# EAGLE schematic ADS126x_hookup (EAGLE 9.6.2)
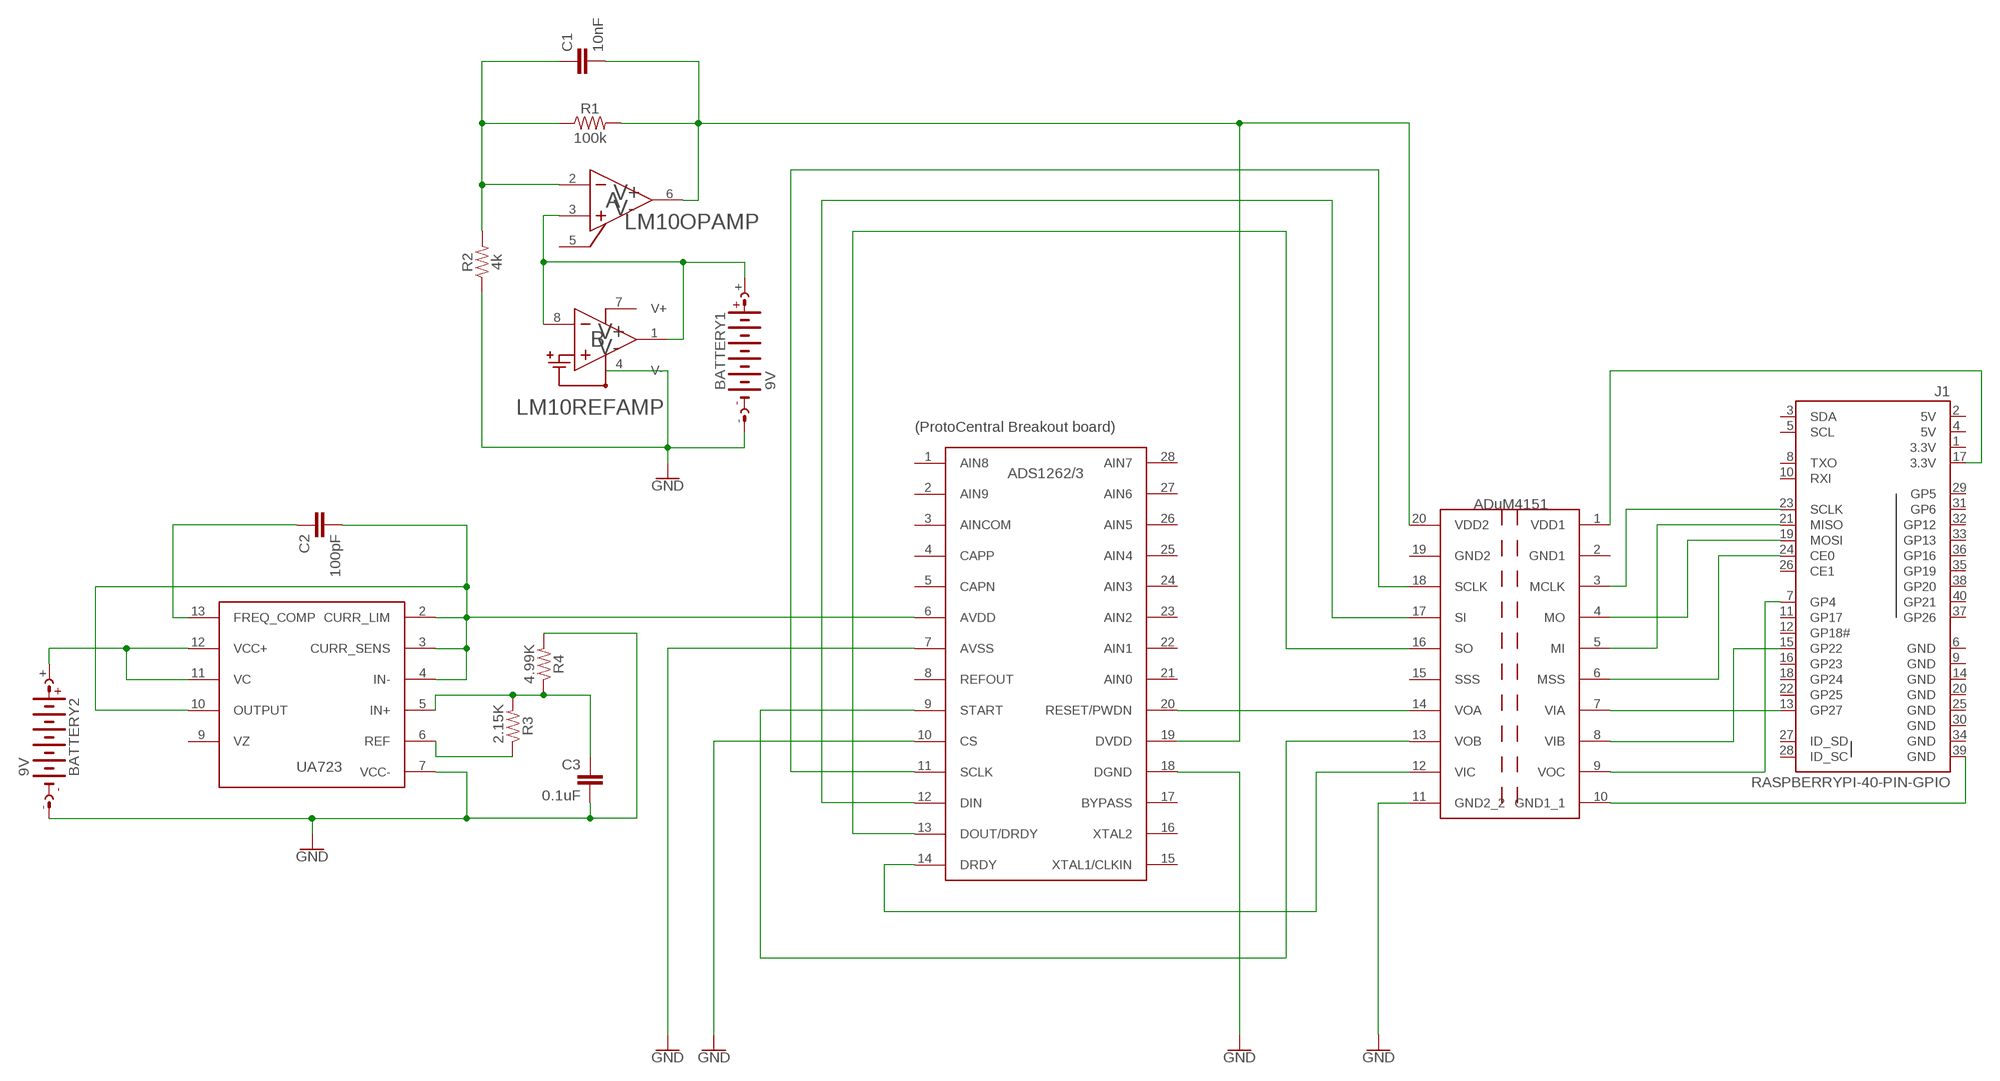
[diagram p0: schematic, sheet 1]

## Parts
BATTERY1  9V  AB9V  [AB9V]
BATTERY2  9V  AB9V  [AB9V]
C1  10nF  10NF-PTH-10MM-10000V-1-%  [CAP-PTH-10MM]
C2  100pF  100PF-0603-50V-5%  [0603]
C3  0.1uF  0.1UF-0603-25V-5%  [0603]
J1  RASPBERRYPI-40-PIN-GPIO  RASPBERRYPI-40-PIN-GPIO_PTH_NO_SHROUD  [2X20]
LM10  LM10  [DIL08-400]
R1  100k  100KOHM-HORIZ-1/4W-1%  [AXIAL-0.3]
R2  4k  RESISTORAXIAL-0.3  [AXIAL-0.3]
R3  2.15K  RESISTORAXIAL-0.3  [AXIAL-0.3]
R4  4.99K  RESISTORAXIAL-0.3  [AXIAL-0.3]
U$1  ADS126X  [PW0028A_M]
U$2  ADUM4151  [RI_20_1_ADI]
UA723  UA723  [DIP14]

## Nets
GND: BATTERY1.- BATTERY2.- C3.2 LM10.4(REFAMP:V-) R2.P$1 R4.P$2 U$1.7(AVSS) U$1.10(CS) U$1.18(DGND) U$2.11(GND2_2) UA723.7(VCC-)
N$1: U$1.14(DRDY) U$2.12(VIC)
N$2: U$1.13(DOUT/DRDY) U$2.16(SO)
N$3: U$1.12(DIN) U$2.17(SI)
N$4: U$1.11(SCLK) U$2.18(SCLK)
N$5: U$1.9(START) U$2.13(VOB)
N$6: U$1.20(RESET/PWDN) U$2.14(VOA)
N$7: J1.39(GND) U$2.10(GND1_1)
N$8: J1.23(SCLK) U$2.3(MCLK)
N$9: J1.21(MISO) U$2.5(MI)
N$10: J1.19(MOSI) U$2.4(MO)
N$11: J1.24(CE0) U$2.6(MSS)
N$12: J1.17(3.3V) U$2.1(VDD1)
N$13: J1.13(GP27) U$2.7(VIA)
N$14: J1.15(GP22) U$2.8(VIB)
N$15: J1.7(GP4) U$2.9(VOC)
N$19: BATTERY1.+ LM10.1(REFAMP:REF_OUT) LM10.3(OPAMP:IN+) LM10.8(REFAMP:REF_FBK)
N$20: C1.1 LM10.2(OPAMP:IN-) R1.P$1 R2.P$2
N$22: C1.2 LM10.6(OPAMP:OUT) R1.P$2 U$1.19(DVDD) U$2.20(VDD2)
N$23: BATTERY2.+ UA723.11(VC) UA723.12(VCC+)
N$24: C2.2 U$1.6(AVDD) UA723.2(CURR_LIM) UA723.3(CURR_SENS) UA723.4(IN-) UA723.10(OUTPUT)
N$25: C2.1 UA723.13(FREQ_COMP)
N$26: R3.P$1 UA723.6(REF)
N$27: C3.1 R3.P$2 R4.P$1 UA723.5(IN+)
Unconnected: J1.3(SDA) J1.5(SCL) J1.8(TXO) J1.10(RXI) J1.11(GP17) J1.12(GP18#) J1.16(GP23) J1.18(GP24) J1.22(GP25) J1.26(CE1) J1.27(ID_SD) J1.28(ID_SC) J1.29(GP5) J1.31(GP6) J1.32(GP12) J1.33(GP13) J1.35(GP19) J1.36(GP16) J1.37(GP26) J1.38(GP20) J1.40(GP21) LM10.5(OPAMP:BAL) LM10.7(REFAMP:V+) U$1.1(AIN8) U$1.2(AIN9) U$1.3(AINCOM) U$1.4(CAPP) U$1.5(CAPN) U$1.8(REFOUT) U$1.15(XTAL1/CLKIN) U$1.16(XTAL2) U$1.17(BYPASS) U$1.21(AIN0) U$1.22(AIN1) U$1.23(AIN2) U$1.24(AIN3) U$1.25(AIN4) U$1.26(AIN5) U$1.27(AIN6) U$1.28(AIN7) U$2.15(SSS) UA723.9(VZ)

## Notes on the sheet
- (ProtoCentral Breakout board)
- UA723

## Power pins joined to a net without a drawn wire
3.3V: J1.1(3.3V)
5V: J1.2(5V) J1.4(5V)
GND: J1.6(GND) J1.9(GND) J1.14(GND) J1.20(GND) J1.25(GND) J1.30(GND) J1.34(GND)
GND1: U$2.2(GND1)
GND2: U$2.19(GND2)

## Library data of the parts
BATTERY1 BATTERY2 = battery:AB9V: 9-V BATTERY CLIP
C1 = SparkFun-Capacitors:10NF: 0.01uF/10nF/10,000pF ceramic capacitors A capacitor is a passive two-terminal electrical component used to store electrical energy temporarily in an electric field. CAP-09321; PROD_ID: CAP-09321
C2 = SparkFun-Capacitors:100PF: 100pF/0.1nF ceramic capacitors A capacitor is a passive two-terminal electrical component used to store electrical energy temporarily in an electric field.; PROD_ID: CAP-07883
C3 = SparkFun-Capacitors:0.1UF: 0.1µF ceramic capacitors A capacitor is a passive two-terminal electrical component used to store electrical energy temporarily in an electric field.; PROD_ID: CAP-08604
J1 = SparkFun-Connectors:RASPBERRYPI-40-PIN-GPIO: Raspberry Pi GPIO Header 2x20 pin connector, as found on B, B+, A+ models. Both shrouded PTH and SMT versions available. SparkFun Products: GPIO Shrouded Header <https://www.sparkfun.com/products/13054>- PTH SparkFun Pi Wedge (Preassembled) <https://www.sparkfun.com/products/13717>
LM10 = lm10:LM10
R1 = SparkFun-Resistors:100KOHM: 100kΩ resistor A resistor is a passive two-terminal electrical component that implements electrical resistance as a circuit element. Resistors act to reduce current flow, and, at the same time, act to lower voltage levels within circuits. - Wikipedia; PROD_ID: RES-12184
R2-R4 = SparkFun-Resistors:RESISTOR: Generic Resistor Package
U$1 = ADS126x:ADS126X
U$2 = ADUM4151:ADUM4151
UA723 = UA723:UA723